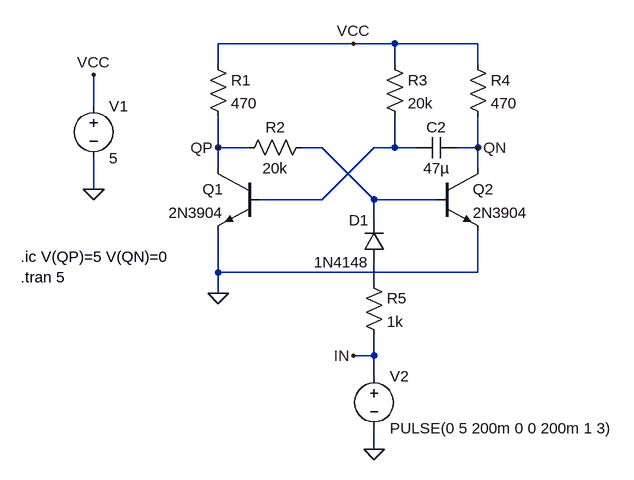
[diagram p0: schematic monostable_npn.asc]
monostable_npn.asc, the LTspice schematic file:
Version 4
SHEET 1 880 680
WIRE 240 -80 32 -80
WIRE 304 -80 240 -80
WIRE 432 -80 304 -80
WIRE 32 -48 32 -80
WIRE 304 -48 304 -80
WIRE 432 -48 432 -80
WIRE -160 16 -160 -32
WIRE 32 80 32 32
WIRE 80 80 32 80
WIRE 192 80 160 80
WIRE 304 80 304 32
WIRE 304 80 272 80
WIRE 336 80 304 80
WIRE 432 80 432 32
WIRE 432 80 400 80
WIRE 32 112 32 80
WIRE 432 112 432 80
WIRE -160 144 -160 96
WIRE 192 160 272 80
WIRE 192 160 96 160
WIRE 272 160 192 80
WIRE 368 160 272 160
WIRE 272 192 272 160
WIRE 32 272 32 208
WIRE 432 272 432 208
WIRE 432 272 32 272
WIRE 272 288 272 256
WIRE 32 304 32 272
WIRE 272 400 272 368
WIRE 272 400 240 400
WIRE 272 432 272 400
WIRE 272 544 272 512
FLAG 32 304 0
FLAG 240 -80 VCC
FLAG 32 80 QP
FLAG 432 80 QN
FLAG -160 144 0
FLAG -160 -32 VCC
FLAG 272 544 0
FLAG 240 400 IN
SYMBOL npn 96 112 M0
SYMATTR InstName Q1
SYMATTR Value 2N3904
SYMBOL npn 368 112 R0
SYMATTR InstName Q2
SYMATTR Value 2N3904
SYMBOL res 16 -64 R0
SYMATTR InstName R1
SYMATTR Value 470
SYMBOL res 176 64 R90
WINDOW 0 0 56 VBottom 2
WINDOW 3 32 56 VTop 2
SYMATTR InstName R2
SYMATTR Value 20k
SYMBOL res 288 -64 R0
SYMATTR InstName R3
SYMATTR Value 20k
SYMBOL res 416 -64 R0
SYMATTR InstName R4
SYMATTR Value 470
SYMBOL cap 400 64 R90
WINDOW 0 0 32 VBottom 2
WINDOW 3 32 32 VTop 2
SYMATTR InstName C2
SYMATTR Value 47µ
SYMBOL voltage -160 0 R0
WINDOW 123 0 0 Left 0
WINDOW 39 0 0 Left 0
SYMATTR InstName V1
SYMATTR Value 5
SYMBOL voltage 272 416 R0
WINDOW 123 0 0 Left 0
WINDOW 39 0 0 Left 0
SYMATTR InstName V2
SYMATTR Value PULSE(0 5 200m 0 0 200m 1 3)
SYMBOL res 256 272 R0
SYMATTR InstName R5
SYMATTR Value 1k
SYMBOL diode 288 256 R180
WINDOW 0 24 64 Left 2
WINDOW 3 24 0 Left 2
SYMATTR InstName D1
SYMATTR Value 1N4148
TEXT -272 248 Left 2 !.ic V(QP)=5 V(QN)=0\n.tran 5

The netlist it stands for:
* monostable_npn.asc
Q1 QP N002 0 0 2N3904
Q2 QN N001 0 0 2N3904
R1 VCC QP 470
R2 N001 QP 20k
R3 VCC N002 20k
R4 VCC QN 470
C2 QN N002 47µ
V1 VCC 0 5
V2 IN 0 PULSE(0 5 200m 0 0 200m 1 3)
R5 N003 IN 1k
D1 N003 N001 1N4148
.model D D
.lib standard.dio
.model NPN NPN
.model PNP PNP
.lib standard.bjt
.ic V(QP)=5 V(QN)=0
.tran 5
.backanno
.end